# EAGLE schematic light sensor assignment 2 (EAGLE 9.6.2)
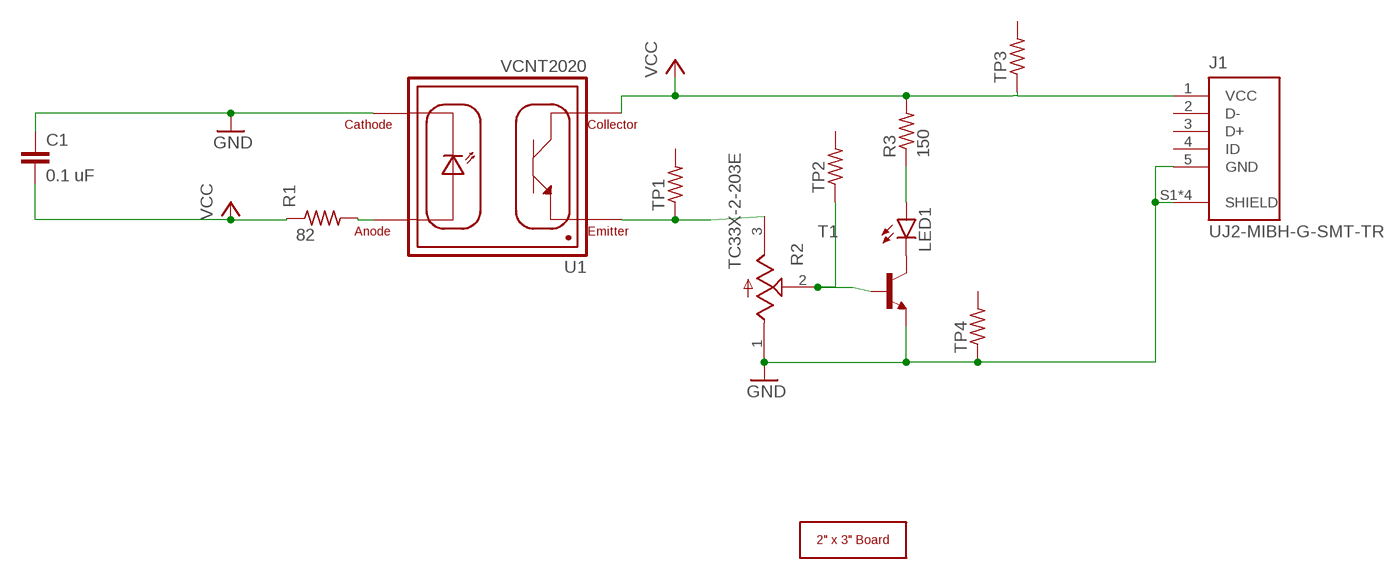
[diagram p0: schematic, sheet 1]

## Parts
C1  0.1 uF  C-EUC1206  [C1206]
J1  UJ2-MIBH-G-SMT-TR  [CUI_UJ2-MIBH-G-SMT-TR]
LED1  LEDSML0805  [SML0805]
R1  82  R-US_R0805  [R0805]
R2  TC33X-2-203E  [TRIM_TC33X-2-203E]
R3  150  R-US_R0805  [R0805]
T1  -NPN-SOT23-EBC  [SOT23-EBC]
TP1  R-US_R1206  [R1206]
TP2  R-US_R1206  [R1206]
TP3  R-US_R1206  [R1206]
TP4  R-US_R1206  [R1206]
U1  VCNT2020  [XDCR_VCNT2020]
U$1  2X3_BOARD_V2  [2X3_BOARD_V2]

## Nets
GND: J1.5(GND) J1.S1(SHIELD) J1.S2(SHIELD) J1.S3(SHIELD) J1.S4(SHIELD) R2.1(CCW) T1.E TP4.1
N$1: R1.2 U1.3(ANODE)
N$2: C1.1 U1.4(CATHODE) ; supply symbol labelled GND
N$3: R2.3(CW) TP1.1 U1.1(EMITTER)
N$4: R2.2(W) T1.B TP2.1
N$5: LED1.C T1.C
N$6: LED1.A R3.1
VCC: C1.2 J1.1(VCC) R1.1 R3.2 TP3.1 U1.2(COLLECTOR)
Unconnected: J1.2(D-) J1.3(D+) J1.4(ID) TP1.2 TP2.2 TP3.2 TP4.2

## Library data of the parts
C1 = rcl:C-EU: CAPACITOR, European symbol; SPICEPREFIX: C
J1 = UJ2-MIBH-G-SMT-TR:UJ2-MIBH-G-SMT-TR: USB micro B type receptacle; MANUFACTURER: CUI; MAXIMUM_PACKAGE_HEIGHT: 2.95 mm; PARTREV: 1.0; STANDARD: Manufacturer Recommendations
LED1 = led:LED: LED OSRAM: - CHIPLED LG R971, LG N971, LY N971, LG Q971, LY Q971, LO R971, LY R971 LH N974, LH R974 LS Q976, LO Q976, LY Q976 LO Q996 - Hyper CHIPLED LW Q18S LB Q993, LB Q99A, LB R99A - SideLED LS A670, LO A670, LY A670, LG A670, LP A670 LB A673, LV A673, LT A673, LW A673 LH A674 LY A675 LS A676, LA A676, LO A676, LY A676, LW A676 LS A679, LY A679, LG A679 - Hyper Micro SIDELED® LS Y876, LA Y876, LO Y876, LY Y876 LT Y87S - SmartLED LW L88C, LW L88S LB L89C, LB L89S, LG L890 LS L89K, LO L89K, LY L89K LS L896, LA L896, LO L896, LY L896 - TOPLED LS T670, LO T670, LY T670, LG T670, LP T670 LSG T670, LSP T670, LSY T670, LOP T670, LYG T670 LG T671, LOG T671, LSG T671 LB T673, LV T673, LT T673, LW T673 LH T674 LS T676, LA T676, LO T676, LY T676, LB T676, LH T676, LSB T676, LW T676 LB T67C, LV T67C, LT T67C, LS T67K, LO T67K, LY T67K, LW E67C LS E67B, LA E67B, LO E67B, LY E67B, LB E67C, LV E67C, LT E67C LW T67C LS T679, LY T679, LG T679 LS T770, LO T770, LY T770, LG T770, LP T770 LB T773, LV T773, LT T773, LW T773 LH T774 LS E675, LA E675, LY E675, LS T675 LS T776, LA T776, LO T776, LY T776, LB T776 LHGB T686 LT T68C, LB T68C - Hyper Mini TOPLED® LB M676 - Mini TOPLED Santana® LG M470 LS M47K, LO M47K, LY M47K Source: http://www.osram.convergy.de LUXEON: - LUMILED® LXK2-PW12-R00, LXK2-PW12-S00, LXK2-PW14-U00, LXK2-PW14-V00 LXK2-PM12-R00, LXK2-PM12-S00, LXK2-PM14-U00 LXK2-PE12-Q00, LXK2-PE12-R00, LXK2-PE12-S00, LXK2-PE14-T00, LXK2-PE14-U00 LXK2-PB12-K00, LXK2-PB12-L00, LXK2-PB12-M00, LXK2-PB14-N00, LXK2-PB14-P00, LXK2-PB14-Q00 LXK2-PR12-L00, LXK2-PR12-M00, LXK2-PR14-Q00, LXK2-PR14-R00 LXK2-PD12-Q00, LXK2-PD12-R00, LXK2-PD12-S00 LXK2-PH12-R00, LXK2-PH12-S00 LXK2-PL12-P00, LXK2-PL12-Q00, LXK2-PL12-R00 Source: www.luxeon.com KINGBRIGHT: KA-3528ASYC Source: www.kingbright.com
R1 R3 TP1-TP4 = rcl:R-US_: RESISTOR, American symbol; SPICEPREFIX: R
R2 = TC33X-2-203E:TC33X-2-203E: Res Trimmer 100K Ohm 25% 1/10W 1(Elec)/1(Mech)Turn (3 X 3.8mm) Foot Print SMD Embossed T/R; CHECK_PRICES: https://www.snapeda.com/parts/TC33X-2-203E/Bourns/view-part/?ref=eda; DESCRIPTION: TRIMMER-3MM OPEN FRAME, 20,000 OHMS | Bourns TC33X-2-203E; DIGIKEY_PART_NUMBER: TC33X-2-203ETR-ND; MF: Bourns; MP: TC33X-2-203E; PACKAGE: 1608 Bourns; SNAPEDA_LINK: https://www.snapeda.com/parts/TC33X-2-203E/Bourns/view-part/?ref=snap
T1 = transistor:*-NPN-: NPN Transistror BF959 corrected 2008.03.06
U1 = VCNT2020:VCNT2020: Reflective Sensor With Ptr Output; CHECK_PRICES: https://www.snapeda.com/parts/VCNT2020/Vishay+Semiconductor+Opto+Division/view-part/?ref=eda; DESCRIPTION: Reflective Optical Sensor 0.02 (0.5mm) 4-SMD Module; DIGIKEY_PART_NUMBER: VCNT2020TR-ND; MF: Vishay; MP: VCNT2020; PACKAGE: None; SNAPEDA_LINK: https://www.snapeda.com/parts/VCNT2020/Vishay+Semiconductor+Opto+Division/view-part/?ref=snap
U$1 = voltera_community_lib:2X3_BOARD